# EAGLE schematic linearni_zdroj (EAGLE 9.5.2)
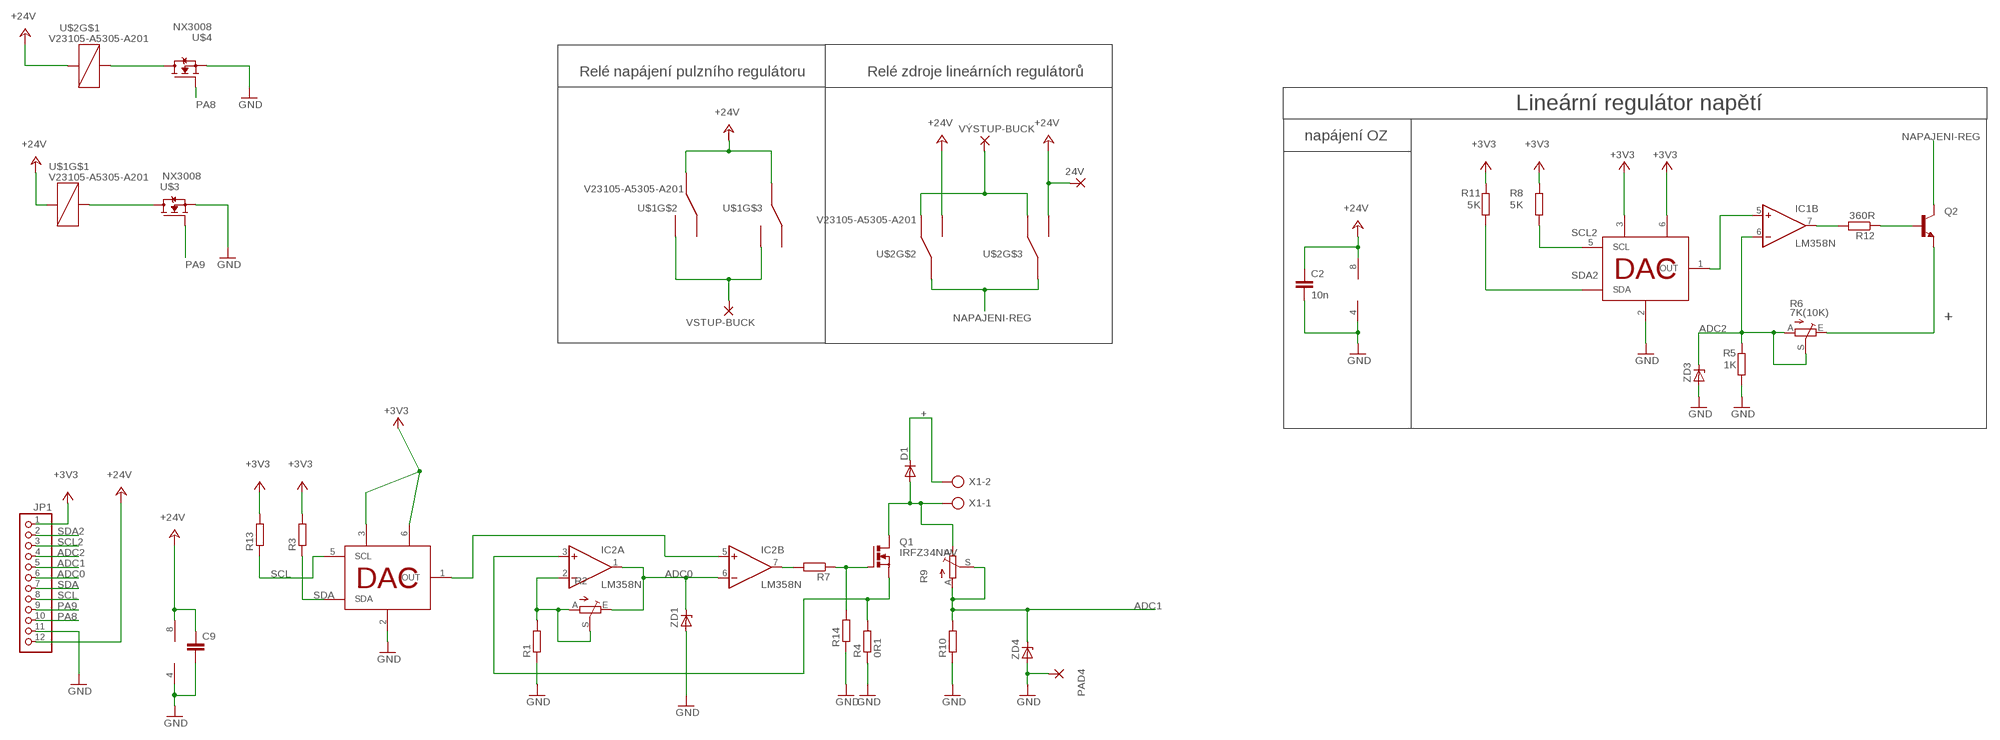
[diagram p0: schematic, sheet 1]

## Parts
24V  3,81/1,4  [3,81/1,4]
C2  10n  C-EUC0805  [C0805]
C9  C-EUC0805  [C0805]
D1  DIODE7  [DO35-7B]
IC1  LM358N  [DIL08]
IC2  LM358N  [DIL08]
JP1  PINHD-1X12  [1X12]
PAD4  3,81/1,4  [3,81/1,4]
Q1  IRFZ34NAV  [TO220AV]
Q2  -NPN-TO220V  [TO220V]
R1  R-EU_R0805  [R0805]
R2  TRIM_EU-CA6V  [CA6V]
R3  R-EU_R0805  [R0805]
R4  0R1  R-EU_0411/15  [0411/15]
R5  1K  R-EU_R0805  [R0805]
R6  7K(10K)  TRIM_EU-CA6V  [CA6V]
R7  R-EU_R0805  [R0805]
R8  5K  R-EU_R0805  [R0805]
R9  TRIM_EU-CA6V  [CA6V]
R10  R-EU_R0805  [R0805]
R11  5K  R-EU_R0805  [R0805]
R12  360R  R-EU_R0805  [R0805]
R13  R-EU_R0805  [R0805]
R14  R-EU_R0805  [R0805]
U$1  V23105-A5305-A201  [V23105-A5305-A201]
U$2  V23105-A5305-A201  [V23105-A5305-A201]
U$3  NX3008  [SOT95P240X110-3N]
U$4  NX3008  [SOT95P240X110-3N]
U$5  MCP4726  [TSOT23-6]
U$6  MCP4726  [TSOT23-6]
VSTUP-BUCK  3,81/1,4  [3,81/1,4]
VÝSTUP-BUCK  3,81/1,4  [3,81/1,4]
X1  AK500/2  [AK500/2]
ZD1  DIODE_ZENER"2  [MINIMELF]
ZD3  DIODE_ZENER"2  [MINIMELF]
ZD4  DIODE_ZENER"2  [MINIMELF]

## Nets
+: D1.C Q2.3(E) R6.E X1.2
+3V3: JP1.1 R3.2 R8.2 R11.2 R13.2 U$5.3(VDD) U$5.6(VREF) U$6.3(VDD) U$6.6(VREF)
+24V: 24V.1(P) C2.1 C9.1 IC1.8(P:V+) IC2.8(P:V+) JP1.12 U$1.1(C$1) U$1.4 U$1.13 U$2.1(C$1) U$2.8 U$2.9
ADC0: IC2.1(A:OUT) IC2.6(B:-IN) JP1.6 R2.E ZD1.C
ADC1: JP1.5 R9.A R9.S R10.2 ZD4.C
ADC2: IC1.6(B:-IN) JP1.4 R5.2 R6.A R6.S ZD3.C
GND: C2.2 C9.2 IC1.4(P:V-) IC2.4(P:V-) JP1.11 PAD4.1(P) R1.1 R4.1 R5.1 R10.1 R14.1 U$3.2(S) U$4.2(S) U$5.2(VSS) U$6.2(VSS) ZD1.A ZD3.A ZD4.A
N$1: IC2.7(B:OUT) R7.2
N$2: Q1.G R7.1 R14.2
N$3: IC2.2(A:-IN) R1.2 R2.A R2.S
N$4: Q2.1(B) R12.1
N$6: IC2.5(B:+IN) U$5.1(OUT)
N$7: D1.A Q1.D R9.E X1.1
N$9: IC1.5(B:+IN) U$6.1(OUT)
N$10: U$2.6 U$2.11 VÝSTUP-BUCK.1(P)
N$12: IC1.7(B:OUT) R12.2
N$16: U$1.16(C$2) U$3.3(D)
N$17: U$2.16(C$2) U$4.3(D)
N$19: U$1.8 U$1.9 VSTUP-BUCK.1(P)
N$20: IC2.3(A:+IN) Q1.S R4.2
NAPAJENI-REG: Q2.2(C) U$2.4 U$2.13
PA8: JP1.10 U$4.1(G)
PA9: JP1.9 U$3.1(G)
SCL: JP1.8 R13.1 U$5.5(SCL)
SCL2: JP1.3 R8.1 U$6.5(SCL)
SDA: JP1.7 R3.1 U$5.4(SDA)
SDA2: JP1.2 R11.1 U$6.4(SDA)
Unconnected: IC1.1(A:OUT) IC1.2(A:-IN) IC1.3(A:+IN) U$1.6 U$1.11

## Notes on the sheet
- Relé napájení pulzního regulátoru | Relé zdroje lineárních regulátorů
- Lineární regulátor napětí
- napájení OZ

## Library data of the parts
24V PAD4 VSTUP-BUCK VÝSTUP-BUCK = wirepad:3,81/1,4: THROUGH-HOLE PAD
C2 C9 = rcl:C-EU: CAPACITOR, European symbol; SPICEPREFIX: C
D1 = devices:DIODE
IC1 IC2 = linear:LM358: OP AMP also LM158; LM258; LM2904 Source: http://cache.national.com/ds/LM/LM158.pdf
JP1 = pinhead:PINHD-1X12: PIN HEADER
Q1 = devices:IRFZ34N
Q2 = transistor:*-NPN-: NPN Transistror BF959 corrected 2008.03.06
R1 R3-R5 R7 R8 R10-R14 = rcl:R-EU_: RESISTOR, European symbol; SPICEPREFIX: R
R2 R6 R9 = pot:TRIM_EU-: POTENTIOMETER
U$1 U$2 = realatka:V23105-A5305-A201
U$3 U$4 = NEXPERIA :NX3008
U$5 U$6 = DAC:MCP4726
X1 = con-ptr500:AK500/2: CONNECTOR; OC_FARNELL: unknown; OC_NEWARK: unknown
ZD1 ZD3 ZD4 = devices:DIODE_ZENER